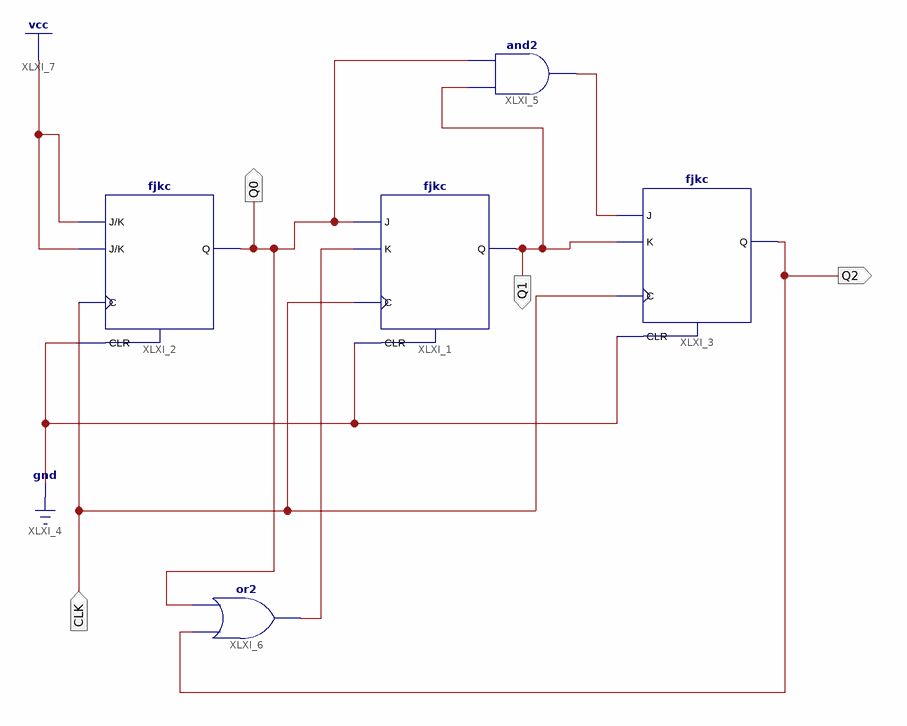
[diagram p0: schematic sheet 1]
// Xilinx ISE schematic ff1.sch (spartan6) as structural Verilog: 5 symbols, 4 ports
module ff1 (
  input  CLK,
  output Q2,
  output Q1,
  output Q0
);

  wire XLXN_6, XLXN_9;

  fjkc XLXI_1 (.C(CLK), .CLR(1'b0), .J(Q0), .K(XLXN_6), .Q(Q1));
  fjkc XLXI_2 (.C(CLK), .CLR(1'b0), .J(1'b1), .K(1'b1), .Q(Q0));
  fjkc XLXI_3 (.C(CLK), .CLR(1'b0), .J(XLXN_9), .K(Q1), .Q(Q2));
  and XLXI_5 (XLXN_9, Q1, Q0);
  or XLXI_6 (XLXN_6, Q2, Q0);
endmodule
